# Altium schematic sheet POWER_BLOCK.SchDoc
size A4
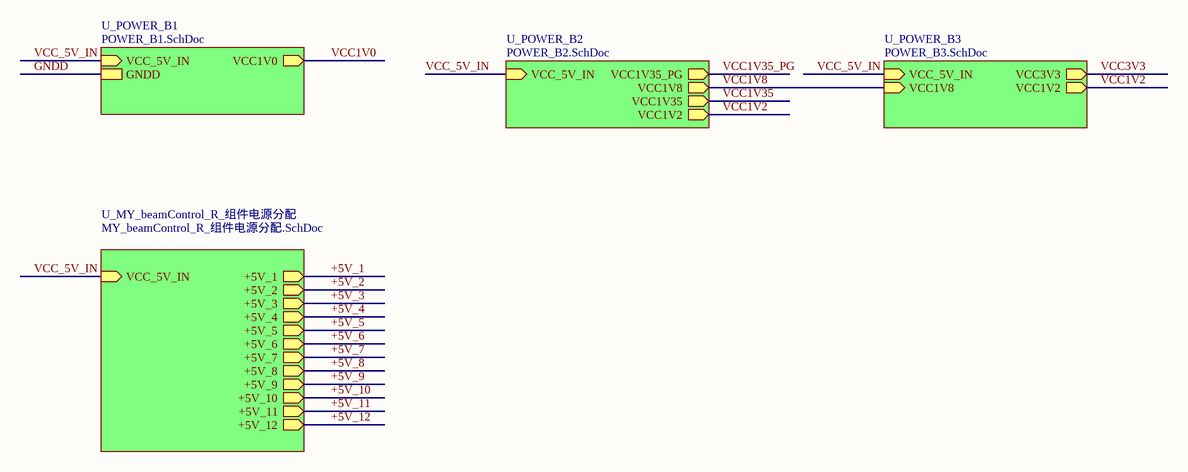
[diagram p0: POWER_BLOCK.SchDoc]

## Sub-sheets
U_MY_beamControl_R_组件电源分配 = MY_beamControl_R_组件电源分配.SchDoc: VCC_5V_IN (in), +5V_1 (out), +5V_2 (out), +5V_3 (out), +5V_4 (out), +5V_5 (out), +5V_6 (out), +5V_7 (out), +5V_8 (out), +5V_9 (out), +5V_10 (out), +5V_11 (out), +5V_12 (out)
U_POWER_B1 = POWER_B1.SchDoc: VCC_5V_IN (in), VCC1V0 (out), GNDD
U_POWER_B2 = POWER_B2.SchDoc: VCC_5V_IN (in), VCC1V35_PG (out), VCC1V8 (out), VCC1V35 (out), VCC1V2 (out)
U_POWER_B3 = POWER_B3.SchDoc: VCC3V3 (out), VCC1V2 (out), VCC_5V_IN (in), VCC1V8 (in)

## Nets
+5V_1: sheet U_MY_beamControl_R_组件电源分配/+5V_1
+5V_2: sheet U_MY_beamControl_R_组件电源分配/+5V_2
+5V_3: sheet U_MY_beamControl_R_组件电源分配/+5V_3
+5V_4: sheet U_MY_beamControl_R_组件电源分配/+5V_4
+5V_5: sheet U_MY_beamControl_R_组件电源分配/+5V_5
+5V_6: sheet U_MY_beamControl_R_组件电源分配/+5V_6
+5V_7: sheet U_MY_beamControl_R_组件电源分配/+5V_7
+5V_8: sheet U_MY_beamControl_R_组件电源分配/+5V_8
+5V_9: sheet U_MY_beamControl_R_组件电源分配/+5V_9
+5V_10: sheet U_MY_beamControl_R_组件电源分配/+5V_10
+5V_11: sheet U_MY_beamControl_R_组件电源分配/+5V_11
+5V_12: sheet U_MY_beamControl_R_组件电源分配/+5V_12
GNDD: sheet U_POWER_B1/GNDD
VCC1V0: sheet U_POWER_B1/VCC1V0
VCC1V2: sheet U_POWER_B2/VCC1V2, sheet U_POWER_B3/VCC1V2
VCC1V8: sheet U_POWER_B2/VCC1V8, sheet U_POWER_B3/VCC1V8
VCC1V35: sheet U_POWER_B2/VCC1V35
VCC1V35_PG: sheet U_POWER_B2/VCC1V35_PG
VCC3V3: sheet U_POWER_B3/VCC3V3
VCC_5V_IN: sheet U_POWER_B1/VCC_5V_IN, sheet U_POWER_B2/VCC_5V_IN, sheet U_POWER_B3/VCC_5V_IN, sheet U_MY_beamControl_R_组件电源分配/VCC_5V_IN